# Altium schematic sheet KX1_DB_PWR.SchDoc
size 260 x 195 mm
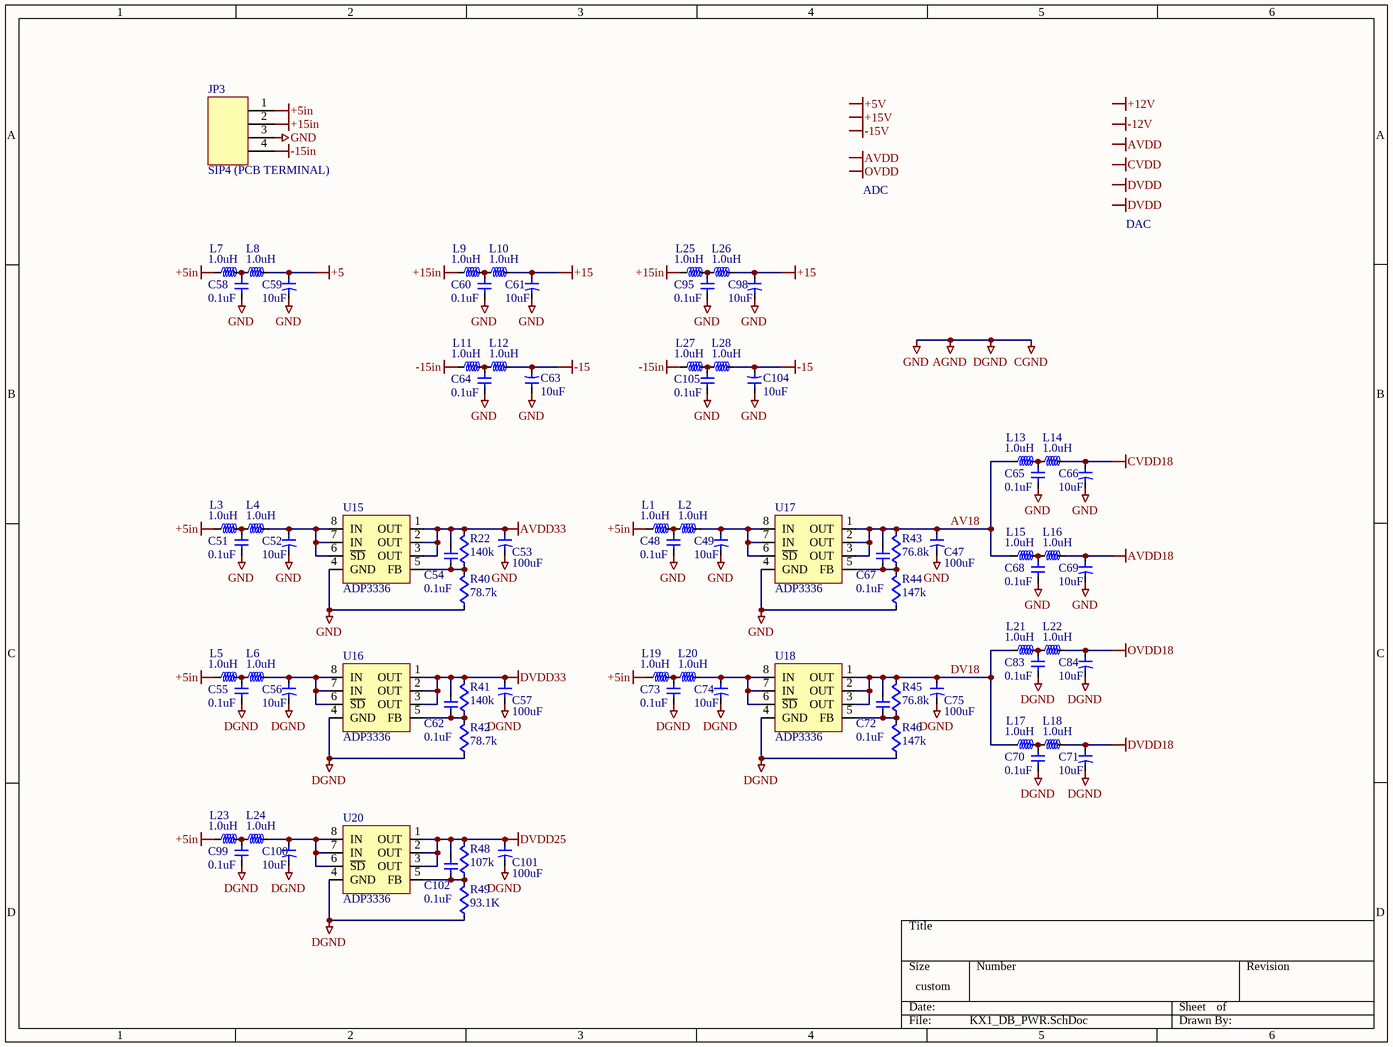
[diagram p0: KX1_DB_PWR.SchDoc]

## Parts
C47  100uF  [1206]
C48  0.1uF  [0603w]
C49  10uF  [1206]
C51  0.1uF  [0603w]
C52  10uF  [1206]
C53  100uF  [1206]
C54  0.1uF  [0603w]
C55  0.1uF  [0603w]
C56  10uF  [1206]
C57  100uF  [1206]
C58  0.1uF  [0603w]
C59  10uF  [1206]
C60  0.1uF  [0603w]
C61  10uF  [1206]
C62  0.1uF  [0603w]
C63  10uF  [1206]
C64  0.1uF  [0603w]
C65  0.1uF  [0603w]
C66  10uF  [1206]
C67  0.1uF  [0603w]
C68  0.1uF  [0603w]
C69  10uF  [1206]
C70  0.1uF  [0603w]
C71  10uF  [1206]
C72  0.1uF  [0603w]
C73  0.1uF  [0603w]
C74  10uF  [1206]
C75  100uF  [1206]
C83  0.1uF  [0603w]
C84  10uF  [1206]
C95  0.1uF  [0603w]
C98  10uF  [1206]
C99  0.1uF  [0603w]
C100  10uF  [1206]
C101  100uF  [1206]
C102  0.1uF  [0603w]
C104  10uF  [1206]
C105  0.1uF  [0603w]
JP3  SIP4 (PCB TERMINAL)  [SIP4MOLEX]
L1  1.0uH  [1210]
L2  1.0uH  [1210]
L3  1.0uH  [0805]
L4  1.0uH  [0805]
L5  1.0uH  [0805]
L6  1.0uH  [0805]
L7  1.0uH  [1210]
L8  1.0uH  [1210]
L9  1.0uH  [1210]
L10  1.0uH  [1210]
L11  1.0uH  [1210]
L12  1.0uH  [1210]
L13  1.0uH  [0805]
L14  1.0uH  [0805]
L15  1.0uH  [1210]
L16  1.0uH  [1210]
L17  1.0uH  [0805]
L18  1.0uH  [0805]
L19  1.0uH  [0805]
L20  1.0uH  [0805]
L21  1.0uH  [0805]
L22  1.0uH  [0805]
L23  1.0uH  [0805]
L24  1.0uH  [0805]
L25  1.0uH  [1210]
L26  1.0uH  [1210]
L27  1.0uH  [1210]
L28  1.0uH  [1210]
R22  140k  [0603w]
R40  78.7k  [0603w]
R41  140k  [0603w]
R42  78.7k  [0603w]
R43  76.8k  [0603w]
R44  147k  [0603w]
R45  76.8k  [0603w]
R46  147k  [0603w]
R48  107k  [0603w]
R49  93.1K  [0603w]
U15  ADP3336  [MSOP08]
U16  ADP3336  [MSOP08]
U17  ADP3336  [MSOP08]
U18  ADP3336  [MSOP08]
U20  ADP3336  [MSOP08]

## Nets
+5: C59.1 L8.2
+5in: JP3.1 L1.1 L3.1 L5.1 L7.1 L19.1 L23.1
+15: C61.1 C98.1 L10.2 L26.2
+15in: JP3.2 L9.1 L25.1
-15: C63.2 C104.2 L12.2 L28.2
-15in: JP3.4 L11.1 L27.1
AGND: C47.2 C48.2 C49.2 C51.2 C52.2 C53.2 C55.2 C56.2 C57.2 C58.2 C59.2 C60.2 C61.2 C63.1 C64.2 C65.2 C66.2 C68.2 C69.2 C70.2 C71.2 C73.2 C74.2 C75.2 C83.2 C84.2 C95.2 C98.2 C99.2 C100.2 C101.2 C104.1 C105.2 JP3.3 R40.1 R42.1 R44.1 R46.1 R49.1 U15.4(GND) U16.4(GND) U17.4(GND) U18.4(GND) U20.4(GND)  [also labelled CGND, DGND, GND]
AVDD18: C69.1 L16.2
AVDD33: C53.1 C54.1 R22.2 U15.1(OUT) U15.2(OUT) U15.3(OUT)
CVDD18: C66.1 L14.2
DVDD18: C71.1 L18.2
DVDD25: C101.1 C102.1 R48.2 U20.1(OUT) U20.2(OUT) U20.3(OUT)
DVDD33: C57.1 C62.1 R41.2 U16.1(OUT) U16.2(OUT) U16.3(OUT)
OVDD18: C84.1 L22.2
AV18: C47.1 C67.1 L13.1 L15.1 R43.2 U17.1(OUT) U17.2(OUT) U17.3(OUT)
DV18: C72.1 C75.1 L17.1 L21.1 R45.2 U18.1(OUT) U18.2(OUT) U18.3(OUT)
NetC48_1: C48.1 L1.2 L2.1
NetC49_1: C49.1 L2.2 U17.6(~{SD}) U17.7(IN) U17.8(IN)
NetC51_1: C51.1 L3.2 L4.1
NetC52_1: C52.1 L4.2 U15.6(~{SD}) U15.7(IN) U15.8(IN)
NetC54_2: C54.2 R22.1 R40.2 U15.5(FB)
NetC55_1: C55.1 L5.2 L6.1
NetC56_1: C56.1 L6.2 U16.6(~{SD}) U16.7(IN) U16.8(IN)
NetC58_1: C58.1 L7.2 L8.1
NetC60_1: C60.1 L9.2 L10.1
NetC62_2: C62.2 R41.1 R42.2 U16.5(FB)
NetC64_1: C64.1 L11.2 L12.1
NetC65_1: C65.1 L13.2 L14.1
NetC67_2: C67.2 R43.1 R44.2 U17.5(FB)
NetC68_1: C68.1 L15.2 L16.1
NetC70_1: C70.1 L17.2 L18.1
NetC72_2: C72.2 R45.1 R46.2 U18.5(FB)
NetC73_1: C73.1 L19.2 L20.1
NetC74_1: C74.1 L20.2 U18.6(~{SD}) U18.7(IN) U18.8(IN)
NetC83_1: C83.1 L21.2 L22.1
NetC95_1: C95.1 L25.2 L26.1
NetC99_1: C99.1 L23.2 L24.1
NetC100_1: C100.1 L24.2 U20.6(~{SD}) U20.7(IN) U20.8(IN)
NetC102_2: C102.2 R48.1 R49.2 U20.5(FB)
NetC105_1: C105.1 L27.2 L28.1

## Notes on the sheet
- ADC
- DAC
- Labels drawn without touching a wire or pin: +5V, +12V, +15V, -12V, -15V, AVDD, CVDD, DVDD, OVDD

## Library data of the parts
C47 C53 C57 C75 C101 = CAPACITOR_SM: capacitor; Manufacturer: TDK Corporation; Manufacturer Part Number: C3216X5R0J107M; Capacitance: 100µF; Voltage - Rated: 6.3V; Tolerance: ±20%; Temperature Coefficient: X5R; Supplier 1: Digi-Key; Supplier Part Number 1: 445-6008-1-ND; RoHS: RoHS Compliant; Category: Capacitors; Stock 1: 10697; Pricing 1: 1=1.24, 10=1.034, 100=0.759, 250=0.66, 500=0.616, 1000=0.484 (USD); Mounting Type: Surface Mount, MLCC; Operating Temperature: -55°C ~ 85°C; Applications: General Purpose; Ratings: -; Package / Case: 1206 (3216 Metric); Size / Dimension: 0.126" L x 0.063" W (3.20mm x 1.60mm); Height: -; Thickness: 0.071" (1.80mm); Lead Spacing: -; Features: Low ESR; Packaging: Cut Tape (CT); Lead Style: -; ComponentLink1URL: http://www.tdk.com/pdf/general_A11.pdf; ComponentLink1Description: http://www.tdk.com/pdf/general_A11.pdf
C48 C51 C54 C55 C58 C60 C62 C64 C65 C67 C68 C70 C72 C73 C83 C95 C99 C102 C105 = CAP_SM: capacitor; Manufacturer: Kemet; Manufacturer Part Number: C0603C104K3RACTU; Capacitance: 0.1µF; Temperature Coefficient: X7R; Tolerance: ±10%; Voltage - Rated: 25V; Applications: General Purpose; Category: Capacitors; ComponentLink1Description: http://www.kemet.com/datasheets&C0603C104K3RACTU; ComponentLink1URL: http://www.kemet.com/datasheets&C0603C104K3RACTU; Features: -; Lead Spacing: -; Lead Style: -; Mounting Type: Surface Mount, MLCC; Operating Temperature: -55°C ~ 125°C; Package / Case: 0603 (1608 Metric); Packaging: Cut Tape (CT); Pricing 1: 10=0.075, 100=0.027, 250=0.01952, 500=0.0144, 1000=0.00975 (USD); Ratings: -; RoHS: RoHS Compliant; Size / Dimension: 0.063" L x 0.032" W (1.60mm x 0.80mm); Stock 1: 2338960; Supplier 1: Digi-Key; Supplier Part Number 1: 399-1281-1-ND; Thickness: 0.80mm
C49 C52 C56 C59 C61 C63 C66 C69 C71 C74 C84 C100 C104 = CAPACITOR_SM: ELECTROLYTIC capacitor; Manufacturer: Nichicon; Manufacturer Part Number: F971C106MAA; Manufacturer Size Code: A; Capacitance: 10µF; Temperature Coefficient: X5R; Tolerance: ±20%; Voltage - Rated: 16V; ESR (Equivalent Series Resistance): 3.500 Ohm; Type: Molded; Applications: General Purpose; Category: Capacitors; ComponentLink1Description: http://nichicon-us.com/english/products/pdf/e-f97.pdf; ComponentLink1URL: http://nichicon-us.com/english/products/pdf/e-f97.pdf; Features: High Reliability; Height: 0.071" (1.80mm); Lead Spacing: -; Lead Style: -; Mounting Type: Surface Mount; Operating Temperature: -55°C ~ 125°C; Package / Case: 1206 (3216 Metric); Packaging: Cut Tape (CT); Pricing 1: 1=0.5, 10=0.398, 100=0.24, 250=0.18, 500=0.1536, 1000=0.12 (USD); Ratings: -; RoHS: RoHS Compliant; Size / Dimension: 0.126" L x 0.063" W (3.20mm x 1.60mm); Stock 1: 885; Supplier 1: Digi-Key; Supplier Part Number 1: 493-4304-1-ND; Thickness: 0.071" (1.80mm); Lifetime @ Temp.: -
C98 = CAPACITOR_SM: ELECTROLYTIC capacitor; Manufacturer: Nichicon; Manufacturer Part Number: F971C106MAA; Manufacturer Size Code: A; Capacitance: 10µF; Voltage - Rated: 16V; Tolerance: ±20%; Temperature Coefficient: X5R; ESR (Equivalent Series Resistance): 3.500 Ohm; Type: Molded; Supplier 1: Digi-Key; Supplier Part Number 1: 493-4304-1-ND; RoHS: RoHS Compliant; Category: Capacitors; Stock 1: 885; Pricing 1: 1=0.5, 10=0.398, 100=0.24, 250=0.18, 500=0.1536, 1000=0.12 (USD); Mounting Type: Surface Mount; Operating Temperature: -55°C ~ 125°C; Applications: General Purpose; Ratings: -; Package / Case: 1206 (3216 Metric); Size / Dimension: 0.126" L x 0.063" W (3.20mm x 1.60mm); Height: 0.071" (1.80mm); Thickness: 0.071" (1.80mm); Lead Spacing: -; Features: High Reliability; Packaging: Cut Tape (CT); Lead Style: -; ComponentLink1URL: http://nichicon-us.com/english/products/pdf/e-f97.pdf; ComponentLink1Description: http://nichicon-us.com/english/products/pdf/e-f97.pdf; Lifetime @ Temp.: -
JP3 = SIP4 (PCB TERMINAL): 4 pin molex connector; Manufacturer: Molex Inc; Connector Type: Header, Unshrouded; Number of Positions: 4; Number of Positions Loaded: All; Pitch: 0.100" (2.54mm); Supplier 1: Digi-Key; Supplier Part Number 1: WM2746-ND; Manufacturer Part Number: 22-29-2041; RoHS: RoHS Compliant; Category: Connectors, Interconnects; Stock 1: 6126; Pricing 1: 1=0.95, 10=0.664, 50=0.5124, 100=0.446, 250=0.3796, 500=0.36062, 1000=0.32266, 2500=0.25623, 5000=0.25243 (USD); Contact Type: Male Pin; Number of Rows: 1; Row Spacing: -; Contact Mating Length: 0.295" (7.49mm); Mounting Type: Through Hole; Termination: Solder; Fastening Type: Friction Lock; Features: -; Contact Finish: Gold; Contact Finish Thickness: 20µin (0.51µm); Color: White; Packaging: Bulk; ComponentLink1URL: http://www.molex.com/pdm_docs/sd/022292041_sd.pdf; ComponentLink1Description: http://www.molex.com/pdm_docs/sd/022292041_sd.pdf
L1 L7 L9 L11 L15 L25 L27 = INDUCTOR_SM: inductor; Manufacturer: Murata Electronics North America; Manufacturer Part Number: LQH32CN1R0M23L; Current: 800mA; DC Resistance (DCR): 117 mOhm Max; Frequency - Test: 1MHz; Inductance: 1µH; Self Resonant Freq: 96MHz; Shielding: Unshielded; Tolerance: ±20%; Type: Ferrite Core; Material - Core: Ferrite; Applications: Power Supplies; Category: Inductors, Coils, Chokes; ComponentLink1Description: http://search.murata.co.jp/Ceramy/image/img/PDF/ENG/L0075S0093LQH32C_23~33.pdf; ComponentLink1URL: http://search.murata.co.jp/Ceramy/image/img/PDF/ENG/L0075S0093LQH32C_23~33.pdf; Current - Saturation: -; Current - Temperature Rise: -; Mounting Type: Surface Mount; Operating Temperature: -40°C ~ 85°C; Package / Case: 1210 (3225 Metric); Packaging: Cut Tape (CT); Q @ Freq: -; RoHS: RoHS Compliant; Supplier 1: Digi-Key; Supplier Part Number 1: 490-2493-1-ND; Stock 1: 5265; Pricing 1: 1=0.27, 10=0.258, 50=0.2422, 100=0.2261, 500=0.17766, 1000=0.14535 (USD)
L2 L8 L10 L12 L16 L26 L28 = INDUCTOR_SM: inductor; Manufacturer: Murata Electronics North America; Manufacturer Part Number: LQH32CN1R0M23L; Inductance: 1µH; Current: 800mA; Type: Ferrite Core; Tolerance: ±20%; Shielding: Unshielded; DC Resistance (DCR): 117 mOhm Max; Self Resonant Freq: 96MHz; Frequency - Test: 1MHz; Material - Core: Ferrite; RoHS: RoHS Compliant; Category: Inductors, Coils, Chokes; Current - Saturation: -; Current - Temperature Rise: -; Q @ Freq: -; Package / Case: 1210 (3225 Metric); Mounting Type: Surface Mount; Packaging: Cut Tape (CT); Operating Temperature: -40°C ~ 85°C; Applications: Power Supplies; ComponentLink1URL: http://search.murata.co.jp/Ceramy/image/img/PDF/ENG/L0075S0093LQH32C_23~33.pdf; ComponentLink1Description: http://search.murata.co.jp/Ceramy/image/img/PDF/ENG/L0075S0093LQH32C_23~33.pdf; Supplier 1: Digi-Key; Supplier Part Number 1: 490-2493-1-ND; Stock 1: 5265; Pricing 1: 1=0.27, 10=0.258, 50=0.2422, 100=0.2261, 500=0.17766, 1000=0.14535 (USD)
L3 L5 L13 L17 L19 L21 L23 = INDUCTOR_SM: inductor; Manufacturer: Murata Electronics North America; Manufacturer Part Number: LQM21FN1R0N00D; Current: 220mA; DC Resistance (DCR): 260 mOhm Max; Frequency - Test: 1MHz; Inductance: 1µH; Self Resonant Freq: 105MHz; Shielding: Shielded; Tolerance: ±30%; Current - Saturation: -; Current - Temperature Rise: -; Mounting Type: Surface Mount; Operating Temperature: -40°C ~ 85°C; Package / Case: 0805 (2012 Metric); Packaging: Cut Tape (CT); Q @ Freq: -; RoHS: RoHS Compliant; Type: -; Supplier 1: Digi-Key; Supplier Part Number 1: 490-4026-1-ND; Stock 1: 0; Pricing 1: 1=0.11, 10=0.104, 50=0.0972, 100=0.0907, 500=0.07122, 1000=0.05828 (USD); Material - Core: -
L4 L6 L14 L18 L20 L22 L24 = INDUCTOR_SM: inductor; Manufacturer: Murata Electronics North America; Manufacturer Part Number: LQM21FN1R0N00D; Inductance: 1µH; Current: 220mA; Tolerance: ±30%; Shielding: Shielded; DC Resistance (DCR): 260 mOhm Max; Self Resonant Freq: 105MHz; Frequency - Test: 1MHz; RoHS: RoHS Compliant; Current - Saturation: -; Current - Temperature Rise: -; Type: -; Q @ Freq: -; Package / Case: 0805 (2012 Metric); Mounting Type: Surface Mount; Packaging: Cut Tape (CT); Operating Temperature: -40°C ~ 85°C; Supplier 1: Digi-Key; Supplier Part Number 1: 490-4026-1-ND; Stock 1: 0; Pricing 1: 1=0.11, 10=0.104, 50=0.0972, 100=0.0907, 500=0.07122, 1000=0.05828 (USD); Material - Core: -
R22 R41 = RES_SM: resistor; Manufacturer: Yageo; Manufacturer Part Number: RC0603FR-07140KL; Power (Watts): 0.1W, 1/10W; Temperature Coefficient: ±100ppm/°C; Tolerance: ±1%; Supplier 1: Digi-Key; Supplier Part Number 1: 311-140KHRCT-ND; RoHS: RoHS Compliant; Category: Resistors; Stock 1: 612355; Pricing 1: 10=0.014, 50=0.0104, 100=0.0079, 250=0.00584, 500=0.00432, 1000=0.00288 (USD); Resistance (Ohms): 140K; Composition: Thick Film; Features: -; Size / Dimension: 0.063" L x 0.031" W (1.60mm x 0.80mm); Height: 0.018" (0.45mm); Number of Terminations: 2; Packaging: Cut Tape (CT); Package / Case: 0603 (1608 Metric); ComponentLink1URL: http://www.yageo.com/documents/recent/PYu-RC0603_51_RoHS_L_4.pdf; ComponentLink1Description: http://www.yageo.com/documents/recent/PYu-RC0603_51_RoHS_L_4.pdf
R40 R42 = RES_SM: resistor; Manufacturer: Yageo; Manufacturer Part Number: RC0603FR-0778K7L; Power (Watts): 0.1W, 1/10W; Temperature Coefficient: ±100ppm/°C; Tolerance: ±1%; Supplier 1: Digi-Key; Supplier Part Number 1: 311-78.7KHRCT-ND; RoHS: RoHS Compliant; Category: Resistors; Stock 1: 134270; Pricing 1: 10=0.014, 50=0.0104, 100=0.0079, 250=0.00584, 500=0.00432, 1000=0.00288 (USD); Resistance (Ohms): 78.7K; Composition: Thick Film; Features: -; Size / Dimension: 0.063" L x 0.031" W (1.60mm x 0.80mm); Height: 0.018" (0.45mm); Number of Terminations: 2; Packaging: Cut Tape (CT); Package / Case: 0603 (1608 Metric); ComponentLink1URL: http://www.yageo.com/documents/recent/PYu-RC0603_51_RoHS_L_4.pdf; ComponentLink1Description: http://www.yageo.com/documents/recent/PYu-RC0603_51_RoHS_L_4.pdf
R43 R45 = RES_SM: resistor; Manufacturer: Yageo; Manufacturer Part Number: RC0603FR-0776K8L; Power (Watts): 0.1W, 1/10W; Temperature Coefficient: ±100ppm/°C; Tolerance: ±1%; Supplier 1: Digi-Key; Supplier Part Number 1: 311-76.8KHRCT-ND; RoHS: RoHS Compliant; Category: Resistors; Stock 1: 91480; Pricing 1: 10=0.014, 50=0.0104, 100=0.0079, 250=0.00584, 500=0.00432, 1000=0.00288 (USD); Resistance (Ohms): 76.8K; Composition: Thick Film; Features: -; Size / Dimension: 0.063" L x 0.031" W (1.60mm x 0.80mm); Height: 0.018" (0.45mm); Number of Terminations: 2; Packaging: Cut Tape (CT); Package / Case: 0603 (1608 Metric); ComponentLink1URL: http://www.yageo.com/documents/recent/PYu-RC0603_51_RoHS_L_4.pdf; ComponentLink1Description: http://www.yageo.com/documents/recent/PYu-RC0603_51_RoHS_L_4.pdf
R44 R46 = RES_SM: resistor; Manufacturer: Yageo; Manufacturer Part Number: RC0603FR-07147KL; Power (Watts): 0.1W, 1/10W; Temperature Coefficient: ±100ppm/°C; Tolerance: ±1%; Supplier 1: Digi-Key; Supplier Part Number 1: 311-147KHRCT-ND; RoHS: RoHS Compliant; Category: Resistors; Stock 1: 53540; Pricing 1: 10=0.014, 50=0.0104, 100=0.0079, 250=0.00584, 500=0.00432, 1000=0.00288 (USD); Resistance (Ohms): 147K; Composition: Thick Film; Features: -; Size / Dimension: 0.063" L x 0.031" W (1.60mm x 0.80mm); Height: 0.018" (0.45mm); Number of Terminations: 2; Packaging: Cut Tape (CT); Package / Case: 0603 (1608 Metric); ComponentLink1URL: http://www.yageo.com/documents/recent/PYu-RC0603_51_RoHS_L_4.pdf; ComponentLink1Description: http://www.yageo.com/documents/recent/PYu-RC0603_51_RoHS_L_4.pdf
R48 = RES_SM: resistor; Manufacturer: Yageo; Manufacturer Part Number: RC0603FR-07107KL; Power (Watts): 0.1W, 1/10W; Temperature Coefficient: ±100ppm/°C; Tolerance: ±1%; Supplier 1: Digi-Key; Supplier Part Number 1: 311-107KHRCT-ND; RoHS: RoHS Compliant; Category: Resistors; Stock 1: 136570; Pricing 1: 10=0.014, 50=0.0104, 100=0.0079, 250=0.00584, 500=0.00432, 1000=0.00288 (USD); Resistance (Ohms): 107K; Composition: Thick Film; Features: -; Size / Dimension: 0.063" L x 0.031" W (1.60mm x 0.80mm); Height: 0.018" (0.45mm); Number of Terminations: 2; Packaging: Cut Tape (CT); Package / Case: 0603 (1608 Metric); ComponentLink1URL: http://www.yageo.com/documents/recent/PYu-RC0603_51_RoHS_L_4.pdf; ComponentLink1Description: http://www.yageo.com/documents/recent/PYu-RC0603_51_RoHS_L_4.pdf
R49 = RES_SM: resistor; Manufacturer: Yageo; Manufacturer Part Number: RC0603FR-0793K1L; Power (Watts): 0.1W, 1/10W; Temperature Coefficient: ±100ppm/°C; Tolerance: ±1%; Supplier 1: Digi-Key; Supplier Part Number 1: 311-93.1KHRCT-ND; RoHS: RoHS Compliant; Category: Resistors; Stock 1: 109138; Pricing 1: 10=0.014, 50=0.0104, 100=0.0079, 250=0.00584, 500=0.00432, 1000=0.00288 (USD); Resistance (Ohms): 93.1K; Composition: Thick Film; Features: -; Size / Dimension: 0.063" L x 0.031" W (1.60mm x 0.80mm); Height: 0.018" (0.45mm); Number of Terminations: 2; Packaging: Cut Tape (CT); Package / Case: 0603 (1608 Metric); ComponentLink1URL: http://www.yageo.com/documents/recent/PYu-RC0603_51_RoHS_L_4.pdf; ComponentLink1Description: http://www.yageo.com/documents/recent/PYu-RC0603_51_RoHS_L_4.pdf
U15-U18 U20 = ADP3336: regulator; Manufacturer: Analog Devices Inc; Manufacturer Part Number: ADP3336ARMZ-REEL7; Regulator Topology: Positive Adjustable; Voltage - Output: 1.5 V ~ 10 V; Voltage - Input: 2.6 V ~ 12 V; Voltage - Dropout (Typical): 0.2V @ 500mA; Number of Regulators: 1; Current - Output: 500mA; Supplier 1: Digi-Key; Supplier Part Number 1: ADP3336ARMZ-REEL7CT-ND; RoHS: RoHS Compliant; Category: Integrated Circuits (ICs); Stock 1: 10613; Pricing 1: 1=3.22, 25=2.484, 100=2.254, 250=2.024, 500=1.748 (USD); Current - Limit (Min): -; Operating Temperature: -40°C ~ 85°C; Mounting Type: Surface Mount; Package / Case: 8-TSSOP, 8-MSOP (0.118", 3.00mm Width); Supplier Device Package: 8-MSOP; Packaging: Cut Tape (CT); ComponentLink1URL: http://www.analog.com/static/imported-files/data_sheets/ADP3336.pdf; ComponentLink1Description: http://www.analog.com/static/imported-files/data_sheets/ADP3336.pdf